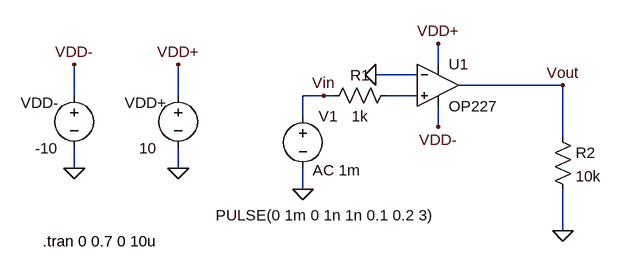
[diagram p0: schematic q3.asc]
q3.asc, the LTspice schematic file:
Version 4.1
SHEET 1 880 680
WIRE 192 128 192 96
WIRE 160 144 96 144
WIRE 384 160 224 160
WIRE -368 176 -368 128
WIRE -208 176 -208 128
WIRE 16 176 -16 176
WIRE 32 176 16 176
WIRE 160 176 112 176
WIRE -16 208 -16 176
WIRE 192 224 192 192
WIRE 384 240 384 160
WIRE -368 288 -368 256
WIRE -208 288 -208 256
WIRE -16 320 -16 288
WIRE 384 384 384 320
FLAG -16 320 0
FLAG 96 144 0
FLAG -368 288 0
FLAG 384 160 Vout
FLAG 16 176 Vin
FLAG -208 288 0
FLAG -368 128 VDD-
FLAG -208 128 VDD+
FLAG 192 96 VDD+
FLAG 192 224 VDD-
FLAG 384 384 0
SYMBOL voltage -16 192 R0
WINDOW 123 15 99 Left 2
WINDOW 39 0 0 Left 0
WINDOW 3 -134 168 Left 2
SYMATTR Value2 AC 1m
SYMATTR Value PULSE(0 1m 0 1n 1n 0.1 0.2 3)
SYMATTR InstName V1
SYMBOL voltage -368 160 R0
WINDOW 0 -82 27 Left 2
WINDOW 3 -60 97 Left 2
WINDOW 123 0 0 Left 0
WINDOW 39 0 0 Left 0
SYMATTR InstName VDD-
SYMATTR Value -10
SYMBOL voltage -208 160 R0
WINDOW 0 -82 27 Left 2
WINDOW 3 -60 97 Left 2
WINDOW 123 0 0 Left 0
WINDOW 39 0 0 Left 0
SYMATTR InstName VDD+
SYMATTR Value 10
SYMBOL OpAmps\\OP227 192 96 R0
SYMATTR InstName U1
SYMBOL res 128 160 R90
WINDOW 0 0 56 VBottom 2
WINDOW 3 32 56 VTop 2
SYMATTR InstName R1
SYMATTR Value 1k
SYMBOL res 368 224 R0
SYMATTR InstName R2
SYMATTR Value 10k
TEXT -416 400 Left 2 !.tran 0 0.7 0 10u

The netlist it stands for:
* q3.asc
V1 Vin 0 PULSE(0 1m 0 1n 1n 0.1 0.2 3) AC 1m
VDD- VDD- 0 -10
VDD+ VDD+ 0 10
X§U1 N001 0 VDD+ VDD- Vout OP227  ; pins In+ In- V+ V- OUT
R1 N001 Vin 1k
R2 Vout 0 10k
.tran 0 0.7 0 10u
.backanno
.end

* Results of the author's LTspice run, read from the files saved beside the schematic
* Operating Point, zero values left out:
*   V(vdd-) = -10 V
*   V(vdd+) = 10 V
*   I(VDD+) = -2.718 mA
*   I(VDD-) = 2.718 mA
*   Ix(u1:3) = 2.718 mA
*   Ix(u1:4) = -2.718 mA
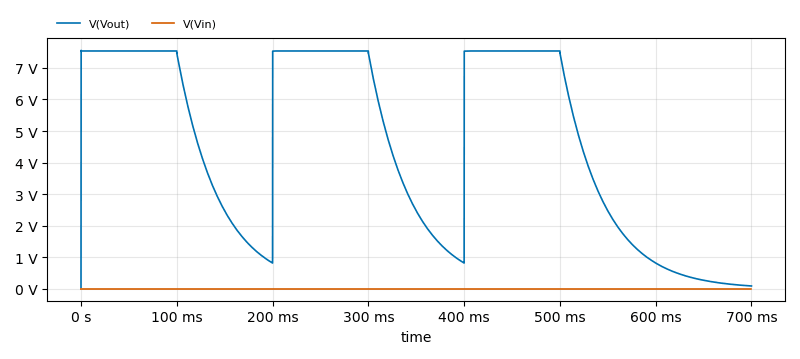
[diagram p1: Transient Analysis of q3.asc, plotted from the saved traces]
* Transient Analysis, 1 run:
*   V(Vout): min 0 V, max 7.556 V, average 4.565 V, rms 5.45 V, last 89.24 mV
*   V(Vin): min 0 V, max 1 mV, average 428.6 µV, rms 654.7 µV, last 0 V